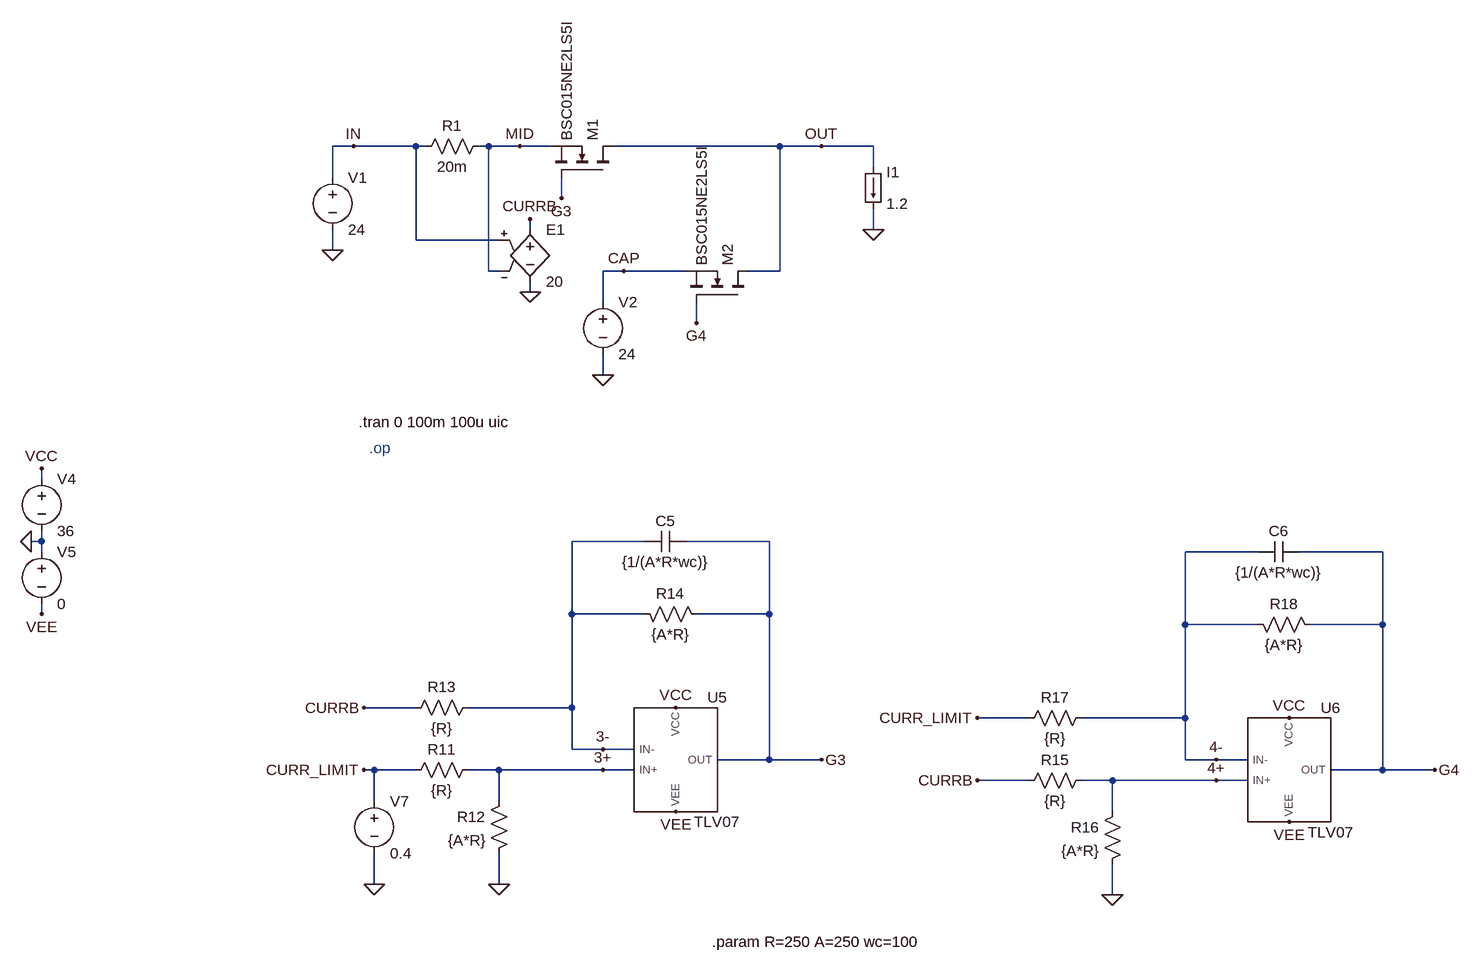
[diagram p0: schematic load_sharing_2.asc]
load_sharing_2.asc, the LTspice schematic file:
Version 4
SHEET 1 1872 1960
WIRE 64 64 32 64
WIRE 160 64 64 64
WIRE 176 64 160 64
WIRE 272 64 256 64
WIRE 320 64 272 64
WIRE 368 64 320 64
WIRE 720 64 464 64
WIRE 784 64 720 64
WIRE 864 64 784 64
WIRE 864 96 864 64
WIRE 32 112 32 64
WIRE 384 144 384 112
WIRE 336 192 336 176
WIRE 864 192 864 160
WIRE 160 208 160 64
WIRE 288 208 160 208
WIRE 32 224 32 192
WIRE 272 256 272 64
WIRE 288 256 272 256
WIRE 480 256 448 256
WIRE 576 256 480 256
WIRE 720 256 720 64
WIRE 720 256 672 256
WIRE 336 288 336 272
WIRE 448 304 448 256
WIRE 592 336 592 304
WIRE 448 416 448 384
WIRE -416 576 -416 560
WIRE -416 672 -416 656
WIRE -416 672 -432 672
WIRE 512 672 400 672
WIRE 704 672 576 672
WIRE -416 688 -416 672
WIRE 1456 688 1344 688
WIRE 1648 688 1520 688
WIRE -416 784 -416 768
WIRE 400 784 400 672
WIRE 512 784 400 784
WIRE 704 784 704 672
WIRE 704 784 592 784
WIRE 1344 800 1344 688
WIRE 1456 800 1344 800
WIRE 1648 800 1648 688
WIRE 1648 800 1536 800
WIRE 160 928 80 928
WIRE 400 928 400 784
WIRE 400 928 240 928
WIRE 1104 944 1024 944
WIRE 1344 944 1344 800
WIRE 1344 944 1184 944
WIRE 400 992 400 928
WIRE 448 992 400 992
WIRE 496 992 448 992
WIRE 704 1008 704 784
WIRE 704 1008 624 1008
WIRE 784 1008 704 1008
WIRE 1344 1008 1344 944
WIRE 1392 1008 1344 1008
WIRE 1440 1008 1392 1008
WIRE 96 1024 80 1024
WIRE 160 1024 96 1024
WIRE 288 1024 240 1024
WIRE 448 1024 288 1024
WIRE 496 1024 448 1024
WIRE 1648 1024 1648 800
WIRE 1648 1024 1568 1024
WIRE 1728 1024 1648 1024
WIRE 1104 1040 1024 1040
WIRE 1232 1040 1184 1040
WIRE 1392 1040 1232 1040
WIRE 1440 1040 1392 1040
WIRE 96 1072 96 1024
WIRE 288 1072 288 1024
WIRE 1232 1088 1232 1040
WIRE 96 1200 96 1152
WIRE 288 1200 288 1152
WIRE 1232 1216 1232 1168
FLAG 32 224 0
FLAG 64 64 IN
FLAG 448 416 0
FLAG 480 256 CAP
FLAG 384 144 G3
FLAG 592 336 G4
FLAG 864 192 0
FLAG -416 784 VEE
FLAG -416 560 VCC
FLAG -432 672 0
FLAG 320 64 MID
FLAG 784 64 OUT
FLAG 288 1200 0
FLAG 560 928 VCC
FLAG 560 1088 VEE
FLAG 784 1008 G3
FLAG 80 928 CURRB
FLAG 80 1024 CURR_LIMIT
FLAG 448 1024 3+
FLAG 448 992 3-
FLAG 96 1200 0
FLAG 1232 1216 0
FLAG 1504 944 VCC
FLAG 1504 1104 VEE
FLAG 1728 1024 G4
FLAG 1024 1040 CURRB
FLAG 1024 944 CURR_LIMIT
FLAG 1392 1040 4+
FLAG 1392 1008 4-
FLAG 336 288 0
FLAG 336 176 CURRB
SYMBOL voltage 32 96 R0
WINDOW 123 0 0 Left 0
WINDOW 39 0 0 Left 0
SYMATTR InstName V1
SYMATTR Value 24
SYMBOL res 272 48 R90
WINDOW 0 0 56 VBottom 2
WINDOW 3 32 56 VTop 2
SYMATTR InstName R1
SYMATTR Value 20m
SYMBOL nmos 464 112 M270
SYMATTR InstName M1
SYMATTR Value BSC015NE2LS5I
SYMBOL voltage 448 288 R0
WINDOW 123 0 0 Left 0
WINDOW 39 0 0 Left 0
SYMATTR InstName V2
SYMATTR Value 24
SYMBOL load 848 96 R0
WINDOW 123 0 0 Left 0
WINDOW 39 0 0 Left 0
SYMATTR InstName I1
SYMATTR Value 1.2
SYMBOL voltage -416 560 R0
WINDOW 123 0 0 Left 0
WINDOW 39 0 0 Left 0
SYMATTR InstName V4
SYMATTR Value 36
SYMBOL voltage -416 672 R0
WINDOW 123 0 0 Left 0
WINDOW 39 0 0 Left 0
SYMATTR InstName V5
SYMATTR Value 0
SYMBOL nmos 672 304 M270
SYMATTR InstName M2
SYMATTR Value BSC015NE2LS5I
SYMBOL TLV07 560 1008 R0
SYMATTR InstName U5
SYMBOL res 256 1008 R90
WINDOW 0 0 56 VBottom 2
WINDOW 3 32 56 VTop 2
SYMATTR InstName R11
SYMATTR Value {R}
SYMBOL res 304 1056 M0
SYMATTR InstName R12
SYMATTR Value {A*R}
SYMBOL res 256 912 R90
WINDOW 0 0 56 VBottom 2
WINDOW 3 32 56 VTop 2
SYMATTR InstName R13
SYMATTR Value {R}
SYMBOL res 608 800 M270
WINDOW 0 32 56 VTop 2
WINDOW 3 0 56 VBottom 2
SYMATTR InstName R14
SYMATTR Value {A*R}
SYMBOL cap 576 656 R90
WINDOW 0 0 32 VBottom 2
WINDOW 3 32 32 VTop 2
SYMATTR InstName C5
SYMATTR Value {1/(A*R*wc)}
SYMBOL voltage 96 1056 R0
WINDOW 123 0 0 Left 0
WINDOW 39 0 0 Left 0
SYMATTR InstName V7
SYMATTR Value 0.4
SYMBOL TLV07 1504 1024 R0
SYMATTR InstName U6
SYMBOL res 1200 1024 R90
WINDOW 0 0 56 VBottom 2
WINDOW 3 32 56 VTop 2
SYMATTR InstName R15
SYMATTR Value {R}
SYMBOL res 1248 1072 M0
SYMATTR InstName R16
SYMATTR Value {A*R}
SYMBOL res 1200 928 R90
WINDOW 0 0 56 VBottom 2
WINDOW 3 32 56 VTop 2
SYMATTR InstName R17
SYMATTR Value {R}
SYMBOL res 1552 816 M270
WINDOW 0 32 56 VTop 2
WINDOW 3 0 56 VBottom 2
SYMATTR InstName R18
SYMATTR Value {A*R}
SYMBOL cap 1520 672 R90
WINDOW 0 0 32 VBottom 2
WINDOW 3 32 32 VTop 2
SYMATTR InstName C6
SYMATTR Value {1/(A*R*wc)}
SYMBOL e 336 176 R0
SYMATTR InstName E1
SYMATTR Value 20
TEXT 72 488 Left 2 !.tran 0 100m 100u uic
TEXT 616 1288 Left 2 !.param R=250 A=250 wc=100
TEXT 88 528 Left 2 ;.op

The netlist it stands for:
* load_sharing_2.asc
V1 IN 0 24
R1 MID IN 20m
M1 OUT G3 MID MID BSC015NE2LS5I
V2 CAP 0 24
I1 OUT 0 1.2
V4 VCC 0 36
V5 0 VEE 0
M2 OUT G4 CAP CAP BSC015NE2LS5I
XU5 3+ 3- VCC VEE G3 TLV07  ; pins IN+ IN- VCC VEE OUT
R11 3+ CURR_LIMIT {R}
R12 3+ 0 {A*R}
R13 3- CURRB {R}
R14 G3 3- {A*R}
C5 G3 3- {1/(A*R*wc)}
V7 CURR_LIMIT 0 0.4
XU6 4+ 4- VCC VEE G4 TLV07  ; pins IN+ IN- VCC VEE OUT
R15 4+ CURRB {R}
R16 4+ 0 {A*R}
R17 4- CURR_LIMIT {R}
R18 G4 4- {A*R}
C6 G4 4- {1/(A*R*wc)}
E1 CURRB 0 IN MID 20
.model NMOS NMOS
.model PMOS PMOS
.lib standard.mos
.tran 0 100m 100u uic
.param R=250 A=250 wc=100
* .op
.lib C:\Users\Tachi\Documents\Nerd Shit\rm_electrical-supercap\SPICE_sims\libraries\TLV07.LIB
.backanno
.end